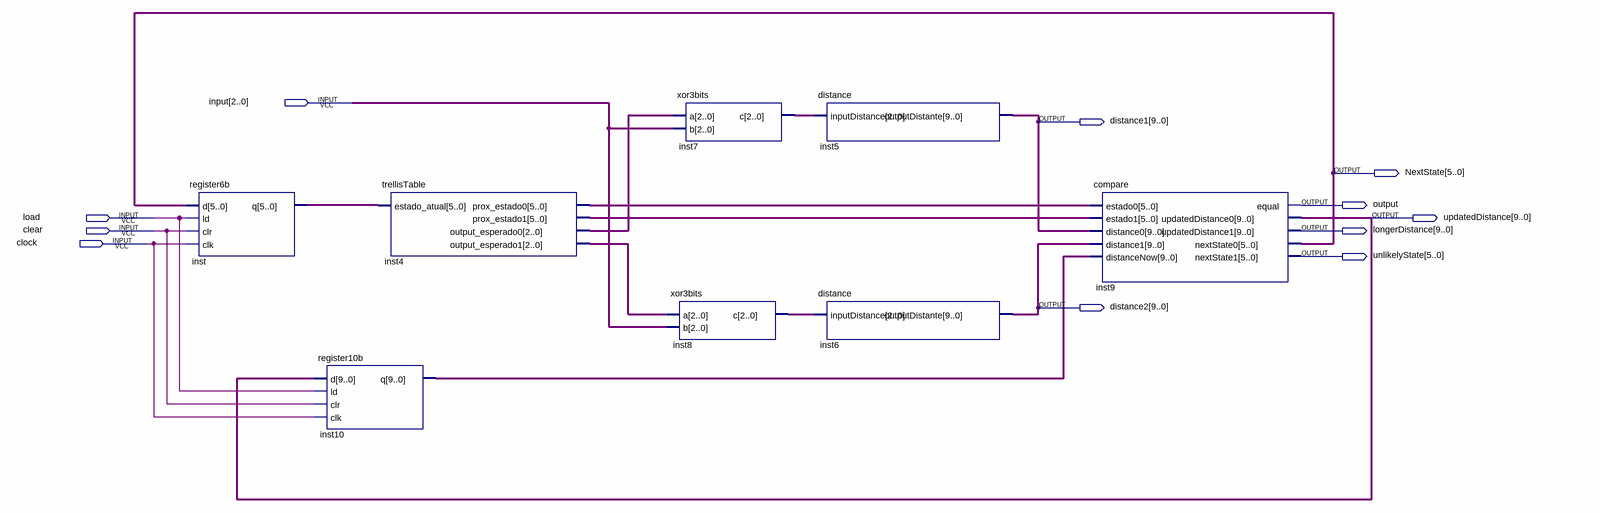
[diagram p0: schematic sheet]
// Quartus schematic vDecoder.bdf as structural Verilog: 8 symbols, 11 pins
module vDecoder (
  input  [2:0] \input ,
  input  load,
  input  clear,
  input  clock,
  output [9:0] distance1,
  output [5:0] NextState,
  output \output ,
  output [9:0] updatedDistance,
  output [9:0] longerDistance,
  output [5:0] unlikelyState,
  output [9:0] distance2
);

  wire [2:0] inst4_output_esperado0, inst4_output_esperado1, inst7_c, inst8_c;
  wire [5:0] inst4_prox_estado0, inst4_prox_estado1, inst_q;
  wire [9:0] inst10_q;

  register6b inst (.d(NextState), .ld(load), .clr(clear), .clk(clock), .q(inst_q));
  register10b inst10 (.d(updatedDistance), .ld(load), .clr(clear), .clk(clock), .q(inst10_q));
  trellisTable inst4 (
    .estado_atual(inst_q), .prox_estado0(inst4_prox_estado0), .prox_estado1(inst4_prox_estado1),
    .output_esperado0(inst4_output_esperado0), .output_esperado1(inst4_output_esperado1));
  xor3bits inst7 (.a(inst4_output_esperado0), .b(\input ), .c(inst7_c));
  xor3bits inst8 (.a(inst4_output_esperado1), .b(\input ), .c(inst8_c));
  distance inst5 (.inputDistance(inst7_c), .outputDistante(distance1));
  distance inst6 (.inputDistance(inst8_c), .outputDistante(distance2));
  compare inst9 (
    .estado0(inst4_prox_estado0), .estado1(inst4_prox_estado1), .distance0(distance1), .distance1(distance2),
    .distanceNow(inst10_q), .equal(\output ), .updatedDistance0(updatedDistance),
    .updatedDistance1(longerDistance), .nextState0(NextState), .nextState1(unlikelyState));
endmodule
